# Altium schematic sheet M2_Drive_00.SchDoc
size B
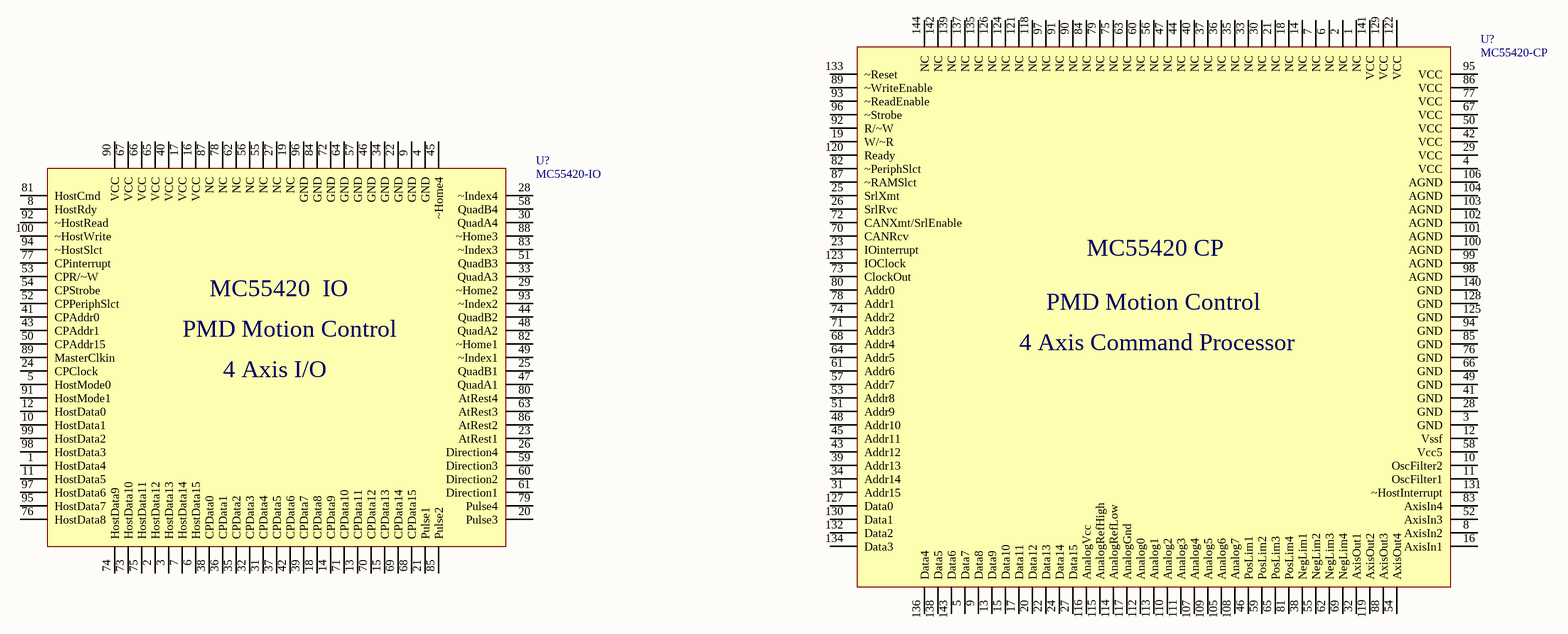
[diagram p0: M2_Drive_00.SchDoc]

## Parts
(Parts that share a designator on the sheet are numbered #1, #2 ... from top to bottom, then left to right.)
U?#1  MC55420-CP  [TQFP144_M]
U?#2  MC55420-IO  [TQFP100_M]

## Nets

Not connected (* = marked no-connect by the designer): U?#1 1(NC) 2(NC) 3(GND) 4(VCC) 5(Data7) 6(NC) 7(NC) 8(AxisIn2) 9(Data8) 10(OscFilter2) 11(OscFilter1) 12(Vssf) 13(Data9) 14(NC) 15(Data10) 16(AxisIn1) 17(Data11) 18(NC) 19(W/~R) 20(Data12) 21(NC) 22(Data13) 23(IOinterrupt) 24(Data14) 25(SrlXmt) 26(SrlRvc) 27(Data15) 28(GND) 29(VCC) 30(NC) 31(Addr15) 32(AxisOut1) 33(NC) 34(Addr14) 35(NC) 36(NC) 37(NC) 38(NegLim1) 39(Addr13) 40(NC) 41(GND) 42(VCC) 43(Addr12) 44(NC) 45(Addr11) 46(PosLim1) 47(NC) 48(Addr10) 49(GND) 50(VCC) 51(Addr9) 52(AxisIn3) 53(Addr8) 54(AxisOut4) 55(NegLim2) 56(NC) 57(Addr7) 58(Vcc5) 59(PosLim2) 60(NC) 61(Addr6) 62(NegLim3) 63(NC) 64(Addr5) 65(PosLim3) 66(GND) 67(VCC) 68(Addr4) 69(NegLim4) 70(CANRcv) 71(Addr3) 72(CANXmt/SrlEnable) 73(ClockOut) 74(Addr2) 75(NC) 76(GND) 77(VCC) 78(Addr1) 79(NC) 80(Addr0) 81(PosLim4) 82(~PeriphSlct) 83(AxisIn4) 84(NC) 85(GND) 86(VCC) 87(~RAMSlct) 88(AxisOut3) 89(~WriteEnable) 90(NC) 91(NC) 92(R/~W) 93(~ReadEnable) 94(GND) 95(VCC) 96(~Strobe) 97(NC) 98(AGND) 99(AGND) 100(AGND) 101(AGND) 102(AGND) 103(AGND) 104(AGND) 105(Analog6) 106(AGND) 107(Analog4) 108(Analog7) 109(Analog5) 110(Analog2) 111(Analog3) 112(Analog0) 113(Analog1) 114(AnalogRefLow) 115(AnalogRefHigh) 116(AnalogVcc) 117(AnalogGnd) 118(NC) 119(AxisOut2) 120(Ready) 121(NC) 122(VCC) 123(IOClock) 124(NC) 125(GND) 126(NC) 127(Data0) 128(GND) 129(VCC) 130(Data1) 131(~HostInterrupt) 132(Data2) 133(~Reset) 134(Data3) 135(NC) 136(Data4) 137(NC) 138(Data5) 139(NC) 140(GND) 141(VCC) 142(NC) 143(Data6) 144(NC); U?#2 1(HostData4) 2(HostData12) 3(HostData13) 4(GND) 5(HostMode0) 6(HostData15) 7(HostData14) 8(HostRdy) 9(GND) 10(HostData1) 11(HostData5) 12(HostData0) 13(CPData11) 14(CPData9) 15(CPData13) 16(VCC) 17(VCC) 18(CPData8) 19(NC) 20(Pulse3) 21(Pulse1) 22(GND) 23(AtRest1) 24(CPClock) 25(QuadB1) 26(Direction4) 27(NC) 28(~Index4) 29(~Home2) 30(QuadA4) 31(CPData4) 32(CPData3) 33(QuadA3) 34(GND) 35(CPData2) 36(CPData1) 37(CPData5) 38(CPData0) 39(CPData7) 40(VCC) 41(CPAddr0) 42(CPData6) 43(CPAddr1) 44(QuadB2) 45(~Home4) 46(GND) 47(QuadA1) 48(QuadA2) 49(~Index1) 50(CPAddr15) 51(QuadB3) 52(CPPeriphSlct) 53(CPR/~W) 54(CPStrobe) 55(NC) 56(NC) 57(GND) 58(QuadB4) 59(Direction3) 60(Direction2) 61(Direction1) 62(NC) 63(AtRest3) 64(GND) 65(VCC) 66(VCC) 67(VCC) 68(CPData15) 69(CPData14) 70(CPData12) 71(CPData10) 72(GND) 73(HostData10) 74(HostData9) 75(HostData11) 76(HostData8) 77(CPinterrupt) 78(NC) 79(Pulse4) 80(AtRest4) 81(HostCmd) 82(~Home1) 83(~Index3) 84(GND) 85(Pulse2) 86(AtRest2) 87(NC) 88(~Home3) 89(MasterClkin) 90(VCC) 91(HostMode1) 92(~HostRead) 93(~Index2) 94(~HostSlct) 95(HostData7) 96(GND) 97(HostData6) 98(HostData3) 99(HostData2) 100(~HostWrite)

## Notes on the sheet
- (in symbol MC55420-CP) MC55420 CP; PMD Motion Control; 4 Axis Command Processor
- (in symbol MC55420-IO) MC55420  IO; PMD Motion Control; 4 Axis I/O

## Library data of the parts
U?#1 = MC55420-CP: PMD Stepper Motor Cmd Processor
U?#2 = MC55420-IO: PMD Stepper Motor I/O Chip